# EAGLE board tesla4x (EAGLE 7.6.0), part 1 of 3
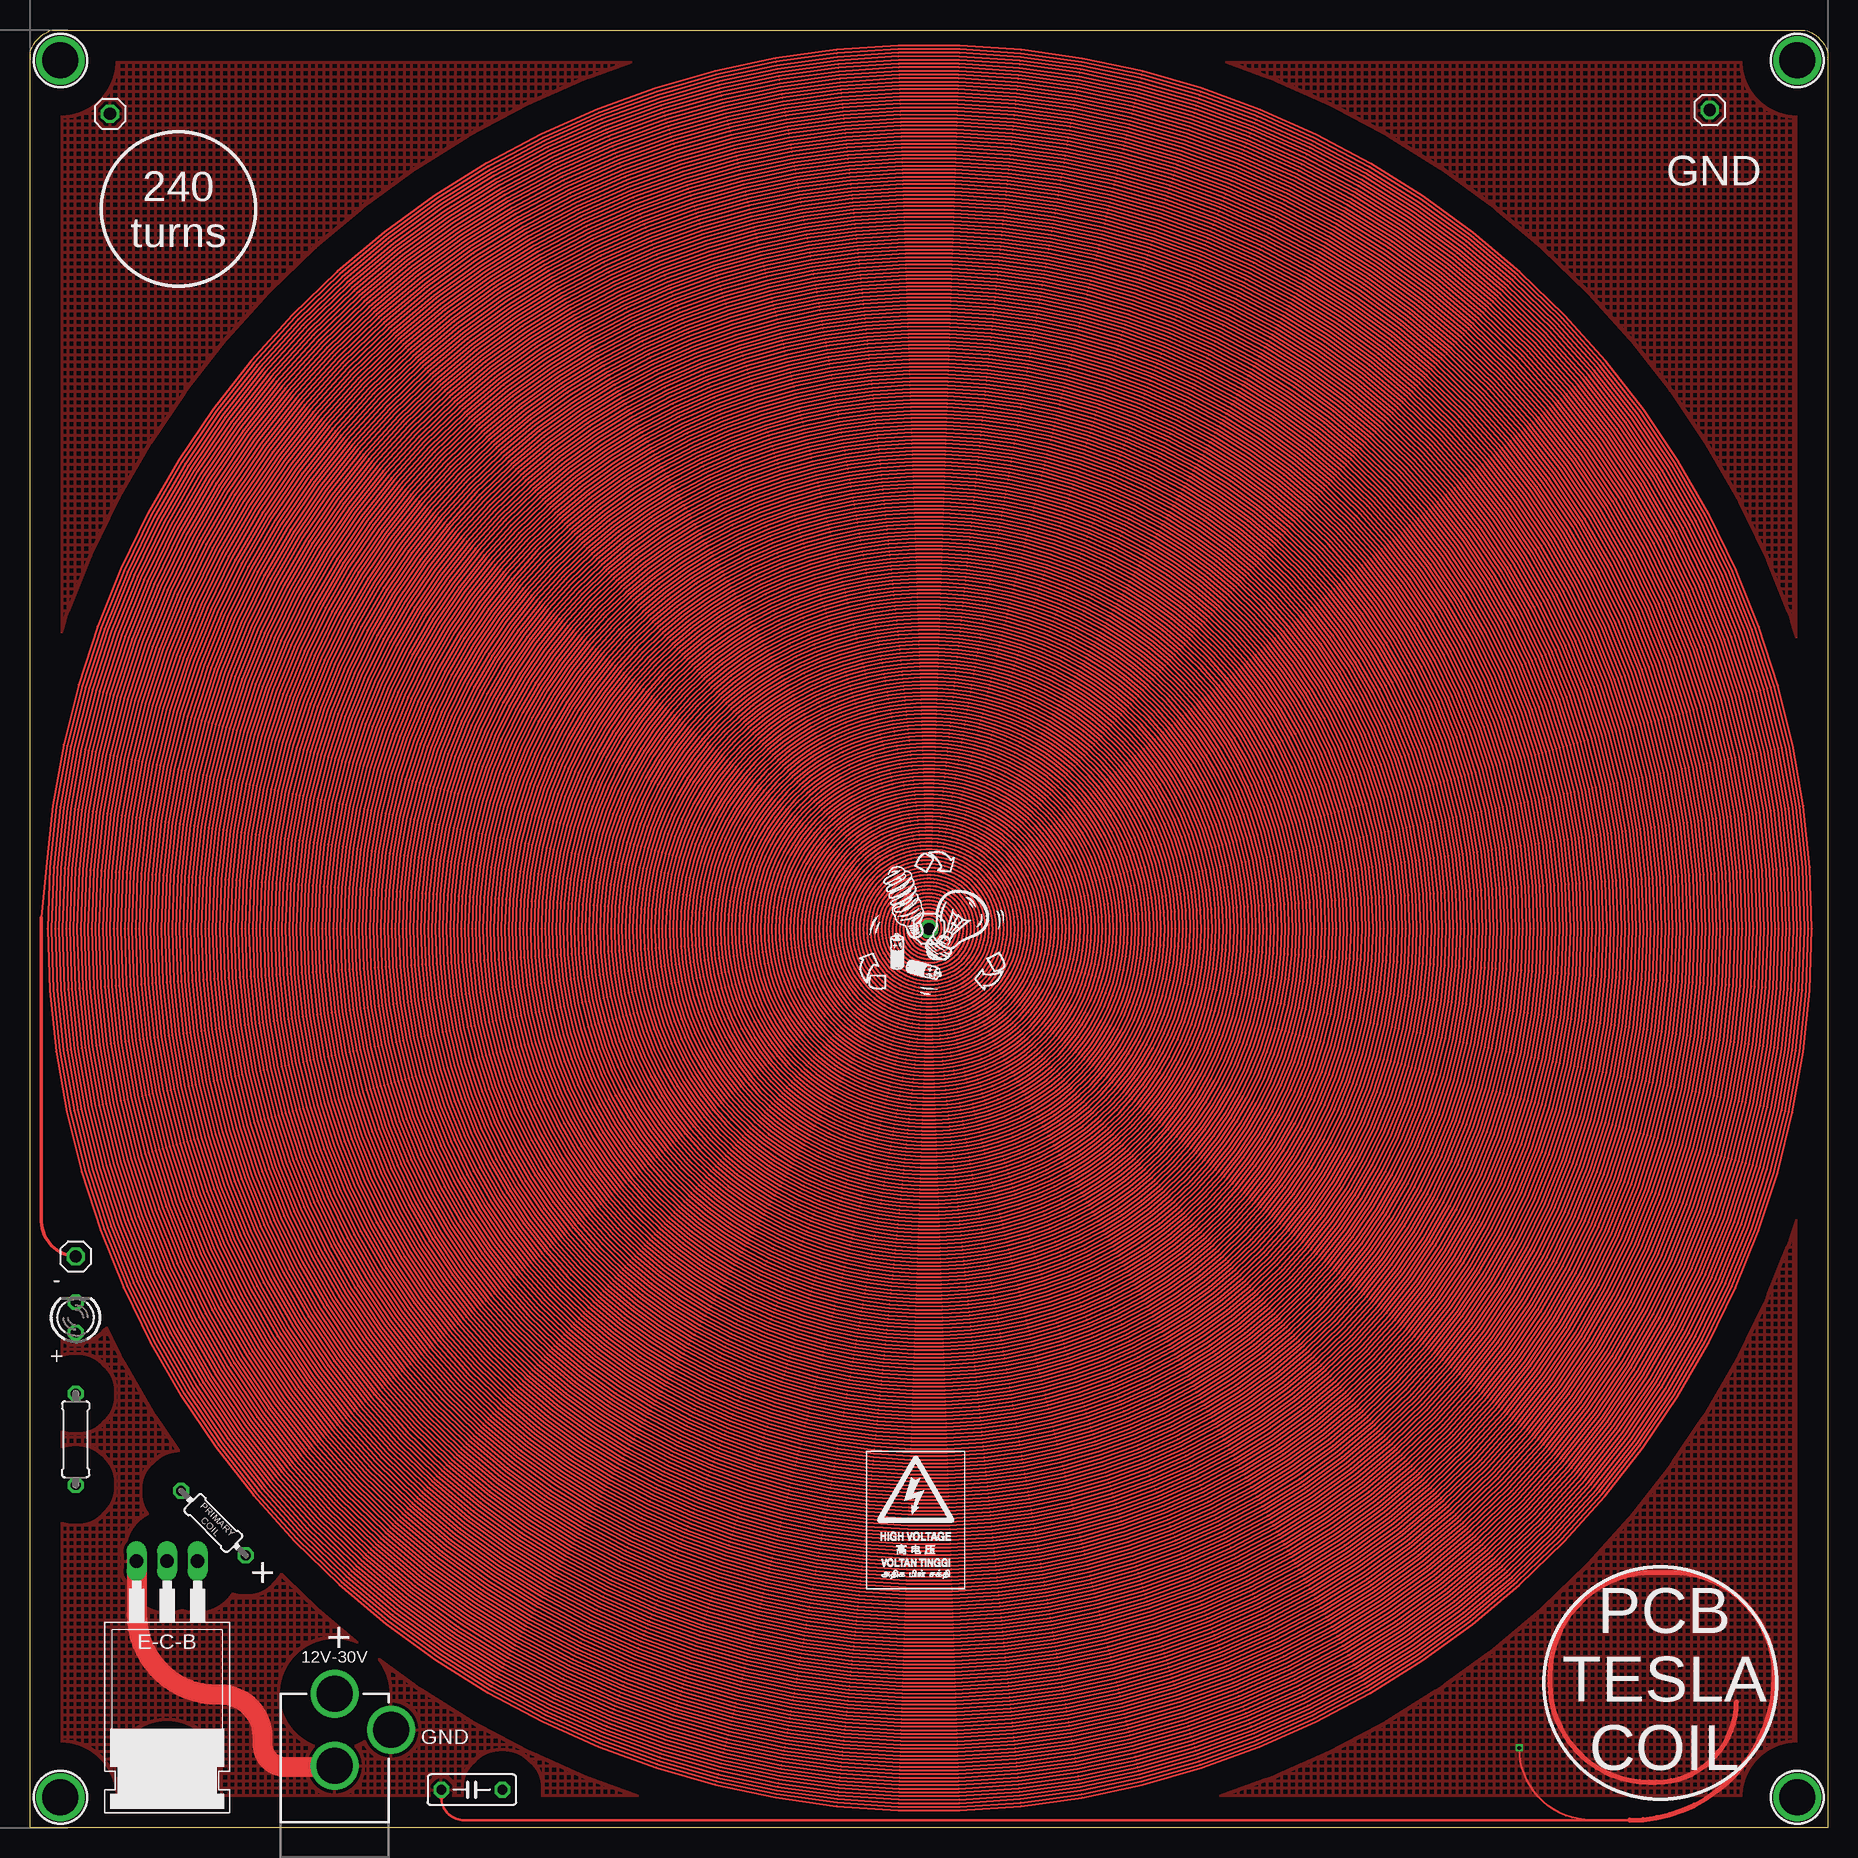
[diagram p1: board, top side]
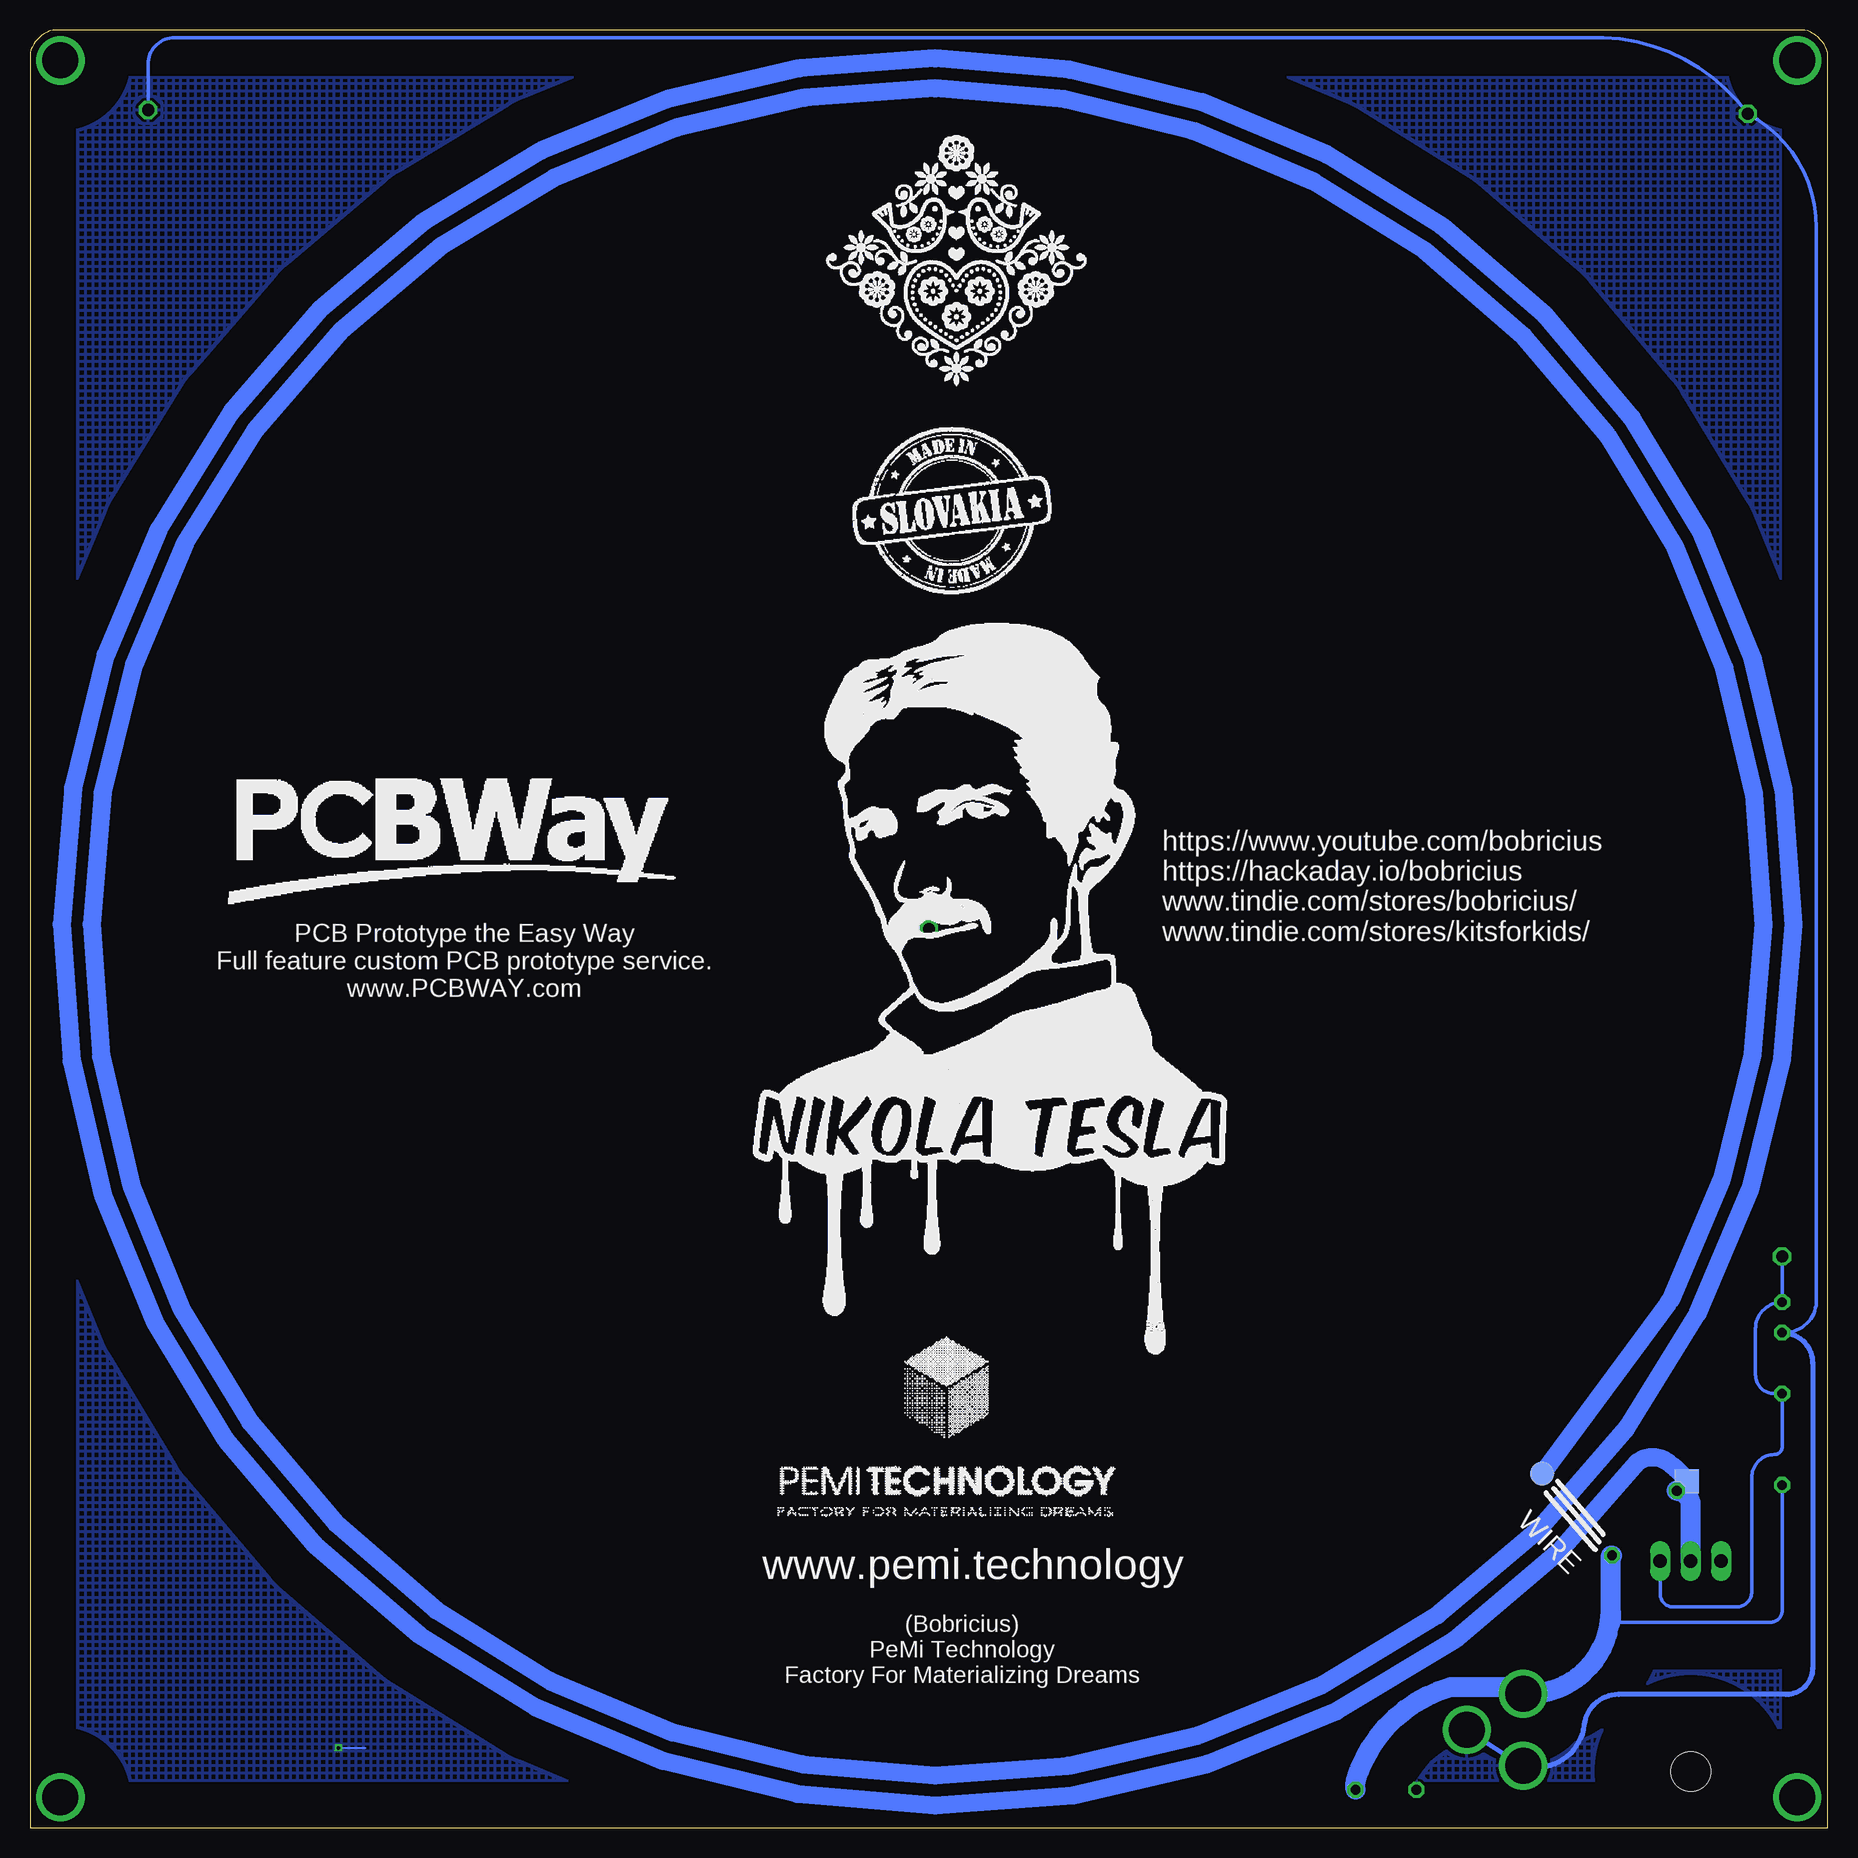
[diagram p2: board, bottom side, seen from below]

Size 149.86 x 149.86 mm. Coordinates in mm from the lower left corner, seen from the top.
Outline: 0,147.96 arc-59 1.91,149.86 147.95,149.86 arc-59 149.86,147.96 149.86,0 0,0 0,147.96
Copper layers (1*16): Top 0.035mm / dielectric 1.5mm / Bottom 0.035mm
Design rules "hackvana": minimum track width 6mil, minimum drill 0.3mm, track to track 6mil, track to pad 6mil, pad to pad 6mil, via to via 6mil, smd to smd 0mil, copper to edge 6mil, drill to drill 6mil, minimum pad ring 10mil, minimum via ring 6mil, stop-mask expansion 2mil, vias tented up to drill 100mil, thermal gap 10mil

## Footprints (pad centres in the part's own frame; a part is rotated, then mirrored left to right if it is on the bottom)
C050-025X075 = drill 0.813 octagon: 1 -2.54,0; 2 2.54,0
POWER_JACK_PTH = drill 2.997: GND 0,7.7; GNDBREAK 4.7,10.7; PWR 0,13.7
1X01 = drill 1.016 octagon: 1 0,0
0204/7 = drill 0.813 octagon: 1 -3.81,0; 2 3.81,0
LED3MM = drill 0.813 octagon: A -1.27,0; K 1.27,0
0207/7 = drill 0.813 octagon: 1 -3.81,0; 2 3.81,0
TO220 = drill 1.118 long: 1 -2.54,-6.35; 2 0,-6.35; 3 2.54,-6.35 | hole 3.302: 0,11.176
TP20SQ = smd 2 x 2: TP 0,0
TP20R = smd 2 x 2: TP 0,0
MOUNTINGHOLE_3.0_PLATEDTHIN = drill 3 pad 3.6: P$1 0,0

## Placement (x,y rotation side)
C1  1u  [C050-025X075]  36.83,3.17 180 top
J1  POWER_JACKPTH  [POWER_JACK_PTH]  25.4,-2.54 0 top
L2  350T Coil  [1X01]  3.81,47.62 0 top
L3  350T Coil  [1X01]  74.93,74.93 0 top
L4  350T Coil  [1X01]  140.02,143.19 0 top
L5  350T Coil  [1X01]  6.67,142.88 0 top
L8  1T Wire  [0204/7]  15.29,25.4 135 top
LED1  [LED3MM]  3.81,42.54 90 top
R4  10k  [0207/7]  3.81,32.38 270 top
T1  [TO220]  11.43,15.87 180 top
TP1  TPTP20SQ  [TP20SQ]  11.75,28.89 180 bottom
TP3  TPTP20R  [TP20R]  23.81,29.53 270 bottom
U$1  MOUNTINGHOLE3.0THIN  [MOUNTINGHOLE_3.0_PLATEDTHIN]  2.54,147.32 0 top
U$2  MOUNTINGHOLE3.0THIN  [MOUNTINGHOLE_3.0_PLATEDTHIN]  147.32,147.32 0 top
U$3  MOUNTINGHOLE3.0THIN  [MOUNTINGHOLE_3.0_PLATEDTHIN]  2.54,2.54 0 top
U$4  MOUNTINGHOLE3.0THIN  [MOUNTINGHOLE_3.0_PLATEDTHIN]  147.32,2.54 0 top
U$5  [HV03]  69.68,19.88 0 top

## Tracks (layer width: path | path; a pad name or v marks a point on that pad's centre or on a via)
GND  (via drill 0.3)
  Top 0.152: 133.03,0.63 130.18,0.63 arc-90 v124.14,6.67
  Top 0.203: 34.29,2.54 arc90 36.19,0.63 133.03,0.63 133.35,0.63
  Top 0.406: C1.2 34.29,2.54 | 133.35,0.63 arc90 145.42,12.7 arc90 136.84,21.27 135.25,21.27 arc90 126.68,12.7 126.68,12.06 arc90 134.94,3.81 135.57,3.81 arc90 142.24,10.48
  Top 1.676: T1.3 8.89,17.78 arc90 15.56,11.11 15.88,11.11 arc-90 19.37,7.62 19.37,6.98 arc90 21.27,5.08 25.32,5.08 arc90 J1.GND
  Bottom 0.152: v124.14,6.67 121.92,6.67
  Bottom 0.305: L4.1 140.02,147 arc90 137.8,149.22 18.73,149.22 arc52 L5.1 arc62 0.95,133.35 0.95,43.81 arc90 LED1.A
  Bottom 0.406: LED1.A arc90 1.27,38.73 1.27,13.33 arc90 3.49,11.11 17.46,11.11 arc-83 20.32,8.57 arc99 J1.GND | J1.GNDBREAK 25.4,5.08
  Bottom 1.676: 25.4,5.4 J1.GND 25.4,5.08
  pour Bottom (isolate 3.81, hatched): 0,149.86 149.86,149.86 149.86,0 0,0
  pour Top (isolate 2.54, hatched): 149.86,149.86 0,149.86 0,0 149.86,0
HV1